# Altium schematic sheet Mezzanine.SchDoc: SPEX - INTERFACE - MEZZANINE
size A4; Author: Derek Belsky; Revision: 0; SheetNumber: 2; SheetTotal: 6
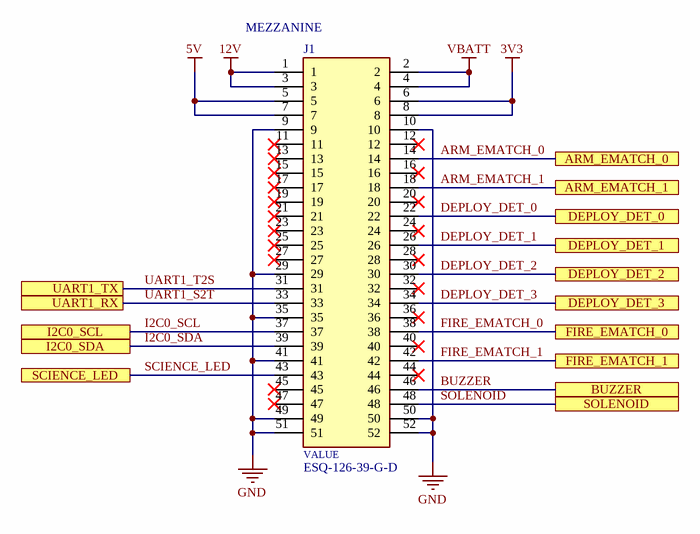
[diagram p0: Mezzanine.SchDoc]

## Parts
J1  ESQ-126-39-G-D  [SAMTEC_ESQ-126-39-G-D]

## Ports
ARM_EMATCH_0, ARM_EMATCH_1, BUZZER, DEPLOY_DET_0, DEPLOY_DET_1, DEPLOY_DET_2, DEPLOY_DET_3, FIRE_EMATCH_0, FIRE_EMATCH_1, I2C0_SCL, I2C0_SDA, SCIENCE_LED, SOLENOID, UART1_RX, UART1_TX

## Nets
3V3: J1.6 J1.8
5V: J1.5 J1.7
12V: J1.1 J1.3
GND: J1.9 J1.10 J1.29 J1.35 J1.41 J1.49 J1.50 J1.51 J1.52
VBATT: J1.2 J1.4
ARM_EMATCH_0: J1.14 ; port ARM_EMATCH_0
ARM_EMATCH_1: J1.18 ; port ARM_EMATCH_1
BUZZER: J1.46 ; port BUZZER
DEPLOY_DET_0: J1.22 ; port DEPLOY_DET_0
DEPLOY_DET_1: J1.26 ; port DEPLOY_DET_1
DEPLOY_DET_2: J1.30 ; port DEPLOY_DET_2
DEPLOY_DET_3: J1.34 ; port DEPLOY_DET_3
FIRE_EMATCH_0: J1.38 ; port FIRE_EMATCH_0
FIRE_EMATCH_1: J1.42 ; port FIRE_EMATCH_1
I2C0_SCL: J1.37 ; port I2C0_SCL
I2C0_SDA: J1.39 ; port I2C0_SDA
SCIENCE_LED: J1.43 ; port SCIENCE_LED
SOLENOID: J1.48 ; port SOLENOID
UART1_S2T: J1.33 ; port UART1_RX
UART1_T2S: J1.31 ; port UART1_TX

Not connected (* = marked no-connect by the designer): J1 11* 12* 13* 15* 16* 17* 19* 20* 21* 23* 24* 25* 27* 28* 32* 36* 40* 44* 45* 47*

## Notes on the sheet
- (near J1) MEZZANINE
- Title
- Size:
- Date:
- A4
- Author
- Time:
- Sheet
- Revision:
- of
- RIT Space Exploration Team
- Rochester Institute of Technology
- 1 Lomb Memorial Drive
- Rochester, NY 14623
- https://spex.rit.edu
- File:
- (in symbol ESQ-126-39-G-D) VALUE

## Library data of the parts
J1 = ESQ-126-39-G-D: 52 Position Elevated Socket Connector Through Hole; MF: Samtec; Value: *; Digi-Key_Purchase_URL: https://www.digikey.com/product-detail/en/samtec-inc/ESQ-126-39-G-D/SAM10462-ND/3601055?utm_source=snapeda&utm_medium=aggregator&utm_campaign=symbol; Package: None; MP: ESQ-126-39-G-D; SnapEDA_Link: https://www.snapeda.com/parts/ESQ-126-39-G-D/Samtec%20Inc./view-part/490181/?ref=snap; Digi-Key_Part_Number: SAM10462-ND